# Altium project PCB_Project.PrjPcb
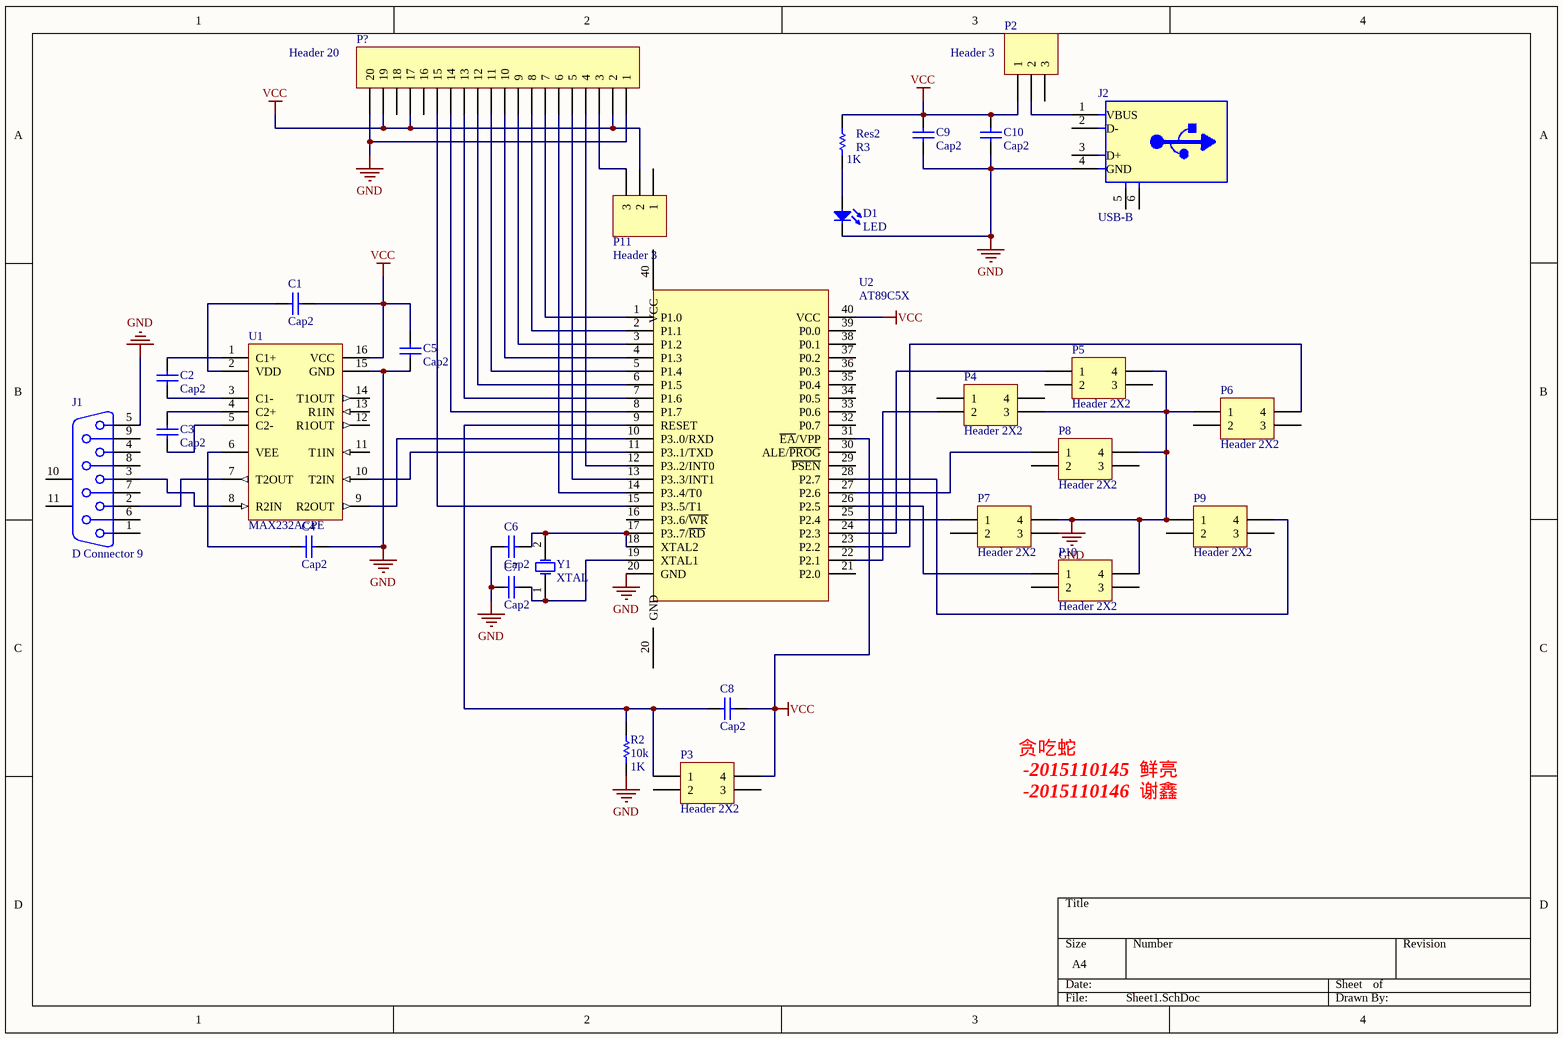
[diagram p0: Sheet1.SchDoc]
1 sheet, 29 parts. Net scope: global (net labels, ports and power ports of the same name join across sheets).
Board file: games.PcbDoc

## Sheet Sheet1.SchDoc
size A4

### Parts
C1  Cap2  [RAD5D-0.1]
C2  Cap2  [RAD5D-0.1]
C3  Cap2  [RAD5D-0.1]
C4  Cap2  [RAD5D-0.1]
C5  Cap2  [RAD5D-0.1]
C6  Cap2  [RAD5D-0.1]
C7  Cap2  [RAD5D-0.1]
C8  Cap2  [RAD5D-0.1]
C9  Cap2  [RAD5D-0.1]
C10  Cap2  [RAD5D-0.1]
D1  LED  [LED-R30-Green]
J1  D Connector 9  [DSUB1.385-2H9]
J2  USB-B  [USB2.5-2H4D]
P2  Header 3  [HDR1X3]
P3  Header 2X2  [TS66H43]
P4  Header 2X2  [TS66H43]
P5  Header 2X2  [TS66H43]
P6  Header 2X2  [TS66H43]
P7  Header 2X2  [TS66H43]
P8  Header 2X2  [TS66H43]
P9  Header 2X2  [TS66H43]
P10  Header 2X2  [TS66H43]
P11  Header 3  [HDR1X3]
P?  Header 20  [HDR1X20]
R2  10k  value 1K  [AXIAL-0.4]
R3  Res2  value 1K  [AXIAL-0.4]
U1  MAX232ACPE  [PE16A]
U2  AT89C5X  [DIP40_600MIL]
Y1  XTAL  [R38]

### Nets
GND: C4.2 C5.1 C6.1 C7.1 C9.1 C10.1 D1.2(K) J1.5 J2.4(GND) P4.3 P5.4 P6.1 P7.4 P8.4 P9.1 P10.4 P?.1 P?.20 R2.1 U1.15(GND) U2.20(GND)
VCC: C1.1 C5.2 C8.2 C9.2 C10.2 P2.1 P3.4 P11.2 P?.2 P?.17 P?.19 R3.1 U1.16(VCC) U2.31(~{EA}/VPP) U2.40(VCC)
NetC1_2: C1.2 U1.2(VDD)
NetC2_1: C2.1 U1.3(C1-)
NetC2_2: C2.2 U1.1(C1+)
NetC3_1: C3.1 U1.5(C2-)
NetC3_2: C3.2 U1.4(C2+)
NetC4_1: C4.1 U1.6(VEE)
NetC6_2: C6.2 U2.17(P3..7/~{RD}) U2.18(XTAL2) Y1.2(OSC2)
NetC7_2: C7.2 U2.19(XTAL1) Y1.1(OSC1)
NetC8_1: C8.1 P3.1 R2.2 U2.9(RESET)
NetD1_1: D1.1(A) R3.2
NetJ1_2: J1.2 U1.7(T2OUT)
NetJ1_3: J1.3 U1.8(R2IN)
NetJ2_1: J2.1(VBUS) P2.2
NetP4_2: P4.2 U2.22(P2.1)
NetP5_1: P5.1 U2.24(P2.3)
NetP6_4: P6.4 U2.23(P2.2)
NetP7_1: P7.1 U2.25(P2.4)
NetP8_1: P8.1 U2.27(P2.6)
NetP9_4: P9.4 U2.28(P2.7)
NetP10_1: P10.1 U2.26(P2.5)
NetP11_3: P11.3 P?.3
NetP?_4: P?.4 U2.12(P3..2/INT0)
NetP?_5: P?.5 U2.13(P3..3/INT1)
NetP?_6: P?.6 U2.14(P3..4/T0)
NetP?_7: P?.7 U2.1(P1.0)
NetP?_8: P?.8 U2.2(P1.1)
NetP?_9: P?.9 U2.3(P1.2)
NetP?_10: P?.10 U2.4(P1.3)
NetP?_11: P?.11 U2.5(P1.4)
NetP?_12: P?.12 U2.6(P1.5)
NetP?_13: P?.13 U2.7(P1.6)
NetP?_14: P?.14 U2.8(P1.7)
NetP?_15: P?.15 U2.15(P3..5/T1)
NetU1_9: U1.9(R2OUT) U2.10(P3..0/RXD)
NetU1_10: U1.10(T2IN) U2.11(P3..1/TXD)

Not connected (* = marked no-connect by the designer): J1 1 4 6 7 8 9 10(MH1) 11(MH2); J2 2(D-) 3(D+) 5 6; P2 3; P3 2 3; P4 1 4; P5 2 3; P6 2 3; P7 2 3; P8 2 3; P9 2 3; P10 2 3; P11 1; P? 16 18; U1 11(T1IN) 12(R1OUT) 13(R1IN) 14(T1OUT); U2 16(P3..6/~{WR}) 21(P2.0) 29(~{PSEN}) 30(ALE/~{PROG}) 32(P0.7) 33(P0.6) 34(P0.5) 35(P0.4) 36(P0.3) 37(P0.2) 38(P0.1) 39(P0.0)

### Notes on the sheet
- 贪吃蛇
  -2015110145  鲜亮
  -2015110146  谢鑫

### Library data of the parts
C1-C10 = Cap2: 针式瓷片电容; Published: 23-Sep-2002; PackageReference: CAPR5-4X5; Publisher: Altium Limited
D1 = LED: 针式LED; Published: 8-Jun-2000; LatestRevisionDate: 08-Jul-2005; LatestRevisionNote: Mech Layer 1 removed.; PackageReference: LED-0; Publisher: Altium Limited
J1 = D Connector 9: Receptacle Assembly, 9 Position, Right Angle; PackageDocument: O; Positions: 9; Published: 15-Jun-2001; LatestRevisionDate: 17-Jul-2002; LatestRevisionNote: Re-released for DXP Platform.; DatasheetDocument: 1-Sep-1999; PackageReference: 788750; Publisher: Altium Limited; Orientation: Right Angle; Gender: Receptacle
J2 = USB-B: USB B型座
P2 P11 = Header 3: Header, 3-Pin; LatestRevisionDate: 17-Jul-2002; LatestRevisionNote: Re-released for DXP Platform.; Publisher: Altium Limited
P3-P10 = Header 2X2: 针座/孔座 双排; LatestRevisionDate: 17-Jul-2002; LatestRevisionNote: Re-released for DXP Platform.; Publisher: Altium Limited
P? = Header 20: Header, 20-Pin; LatestRevisionDate: 17-Jul-2002; LatestRevisionNote: Re-released for DXP Platform.; Publisher: Altium Limited
R2 R3 = Res2: 小功率针式电阻; Published: 8-Jun-2000; LatestRevisionDate: 17-Jul-2002; LatestRevisionNote: Re-released for DXP Platform.; PackageReference: AXIAL-0.4; Publisher: Altium Limited
U1 = MAX232ACPE: +5V Powered, Multi-Channel RS-232 Driver/Receiver; Published: 16-Jan-2001; LatestRevisionDate: 29-May-2009; LatestRevisionNote: Component Body Added.; PackageVersion: 1997; PackageReference: PE16A; Publisher: Altium Limited; PackageDescription: DIP, 16-Pin, Row Spacing 7.62 mm, Pitch 2.54 mm; Code_JEDEC: MS-001-BB; ComponentLink1Description: Manufacturer Link; ComponentLink1URL: http://www.maxim-ic.com/; ComponentLink2Description: Datasheet; ComponentLink2URL: http://pdfserv.maxim-ic.com/en/ds/MAX220-MAX249.pdf
U2 = AT89C5X: 40P 常规 DIP
Y1 = XTAL: Crystal Oscillator; Published: 8-Jun-2000; LatestRevisionDate: 17-Jul-2002; LatestRevisionNote: Re-released for DXP Platform.; PackageReference: R38; Publisher: Altium Limited; PackageDescription: Crystal, Thru-Hole; 2 Leads; Body 3.1 x 8.2 mm (Dia.xH)